# EAGLE design hdmispi (EAGLE 7.6.0)
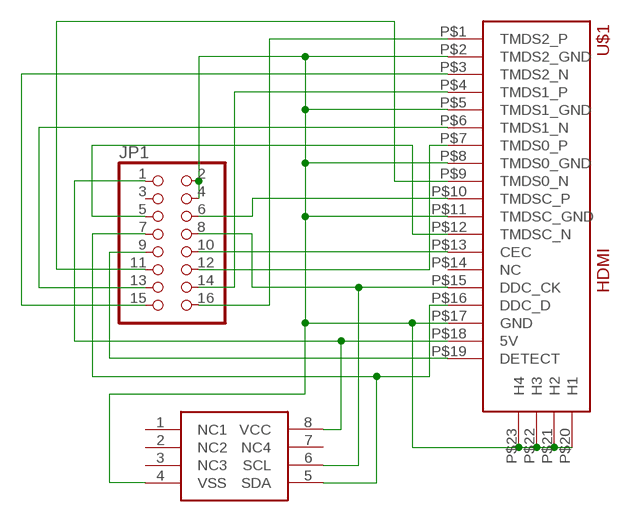
[diagram p0: schematic, sheet 1]

## Parts
JP1  PINHD-2X8  [2X08]
U$1  HDMI  [HDMI]
U$2  I2CEEPROM-SOIC8  [SOIC8]

## Nets
5V: JP1.1 U$1.P$18(5V) U$2.8(VCC)
CEC: JP1.10 U$1.P$13(CEC)
DDC_CK: JP1.8 U$1.P$15(DDC_CK) U$2.6(SCL)
DDC_D: JP1.7 U$1.P$16(DDC_D) U$2.5(SDA)
DETECT: JP1.9 U$1.P$19(DETECT)
GND: JP1.2 JP1.4 U$1.P$2(TMDS2_GND) U$1.P$5(TMDS1_GND) U$1.P$8(TMDS0_GND) U$1.P$11(TMDSC_GND) U$1.P$17(GND) U$1.P$20(H1) U$1.P$21(H2) U$1.P$22(H3) U$1.P$23(H4) U$2.4(VSS)
TMDS0_N: JP1.11 U$1.P$9(TMDS0_N)
TMDS0_P: JP1.12 U$1.P$7(TMDS0_P)
TMDS1_N: JP1.13 U$1.P$6(TMDS1_N)
TMDS1_P: JP1.14 U$1.P$4(TMDS1_P)
TMDS2_N: JP1.15 U$1.P$3(TMDS2_N)
TMDS2_P: JP1.16 U$1.P$1(TMDS2_P)
TMDSC_N: JP1.5 U$1.P$12(TMDSC_N)
TMDSC_P: JP1.6 U$1.P$10(TMDSC_P)
Unconnected: JP1.3 U$1.P$14(NC) U$2.1(NC1) U$2.2(NC2) U$2.3(NC3) U$2.7(NC4)

## Library data of the parts
JP1 = pinhead:PINHD-2X8: PIN HEADER
U$1 = hdmispi:HDMI
U$2 = hdmispi:I2CEEPROM-SOIC8

## Board
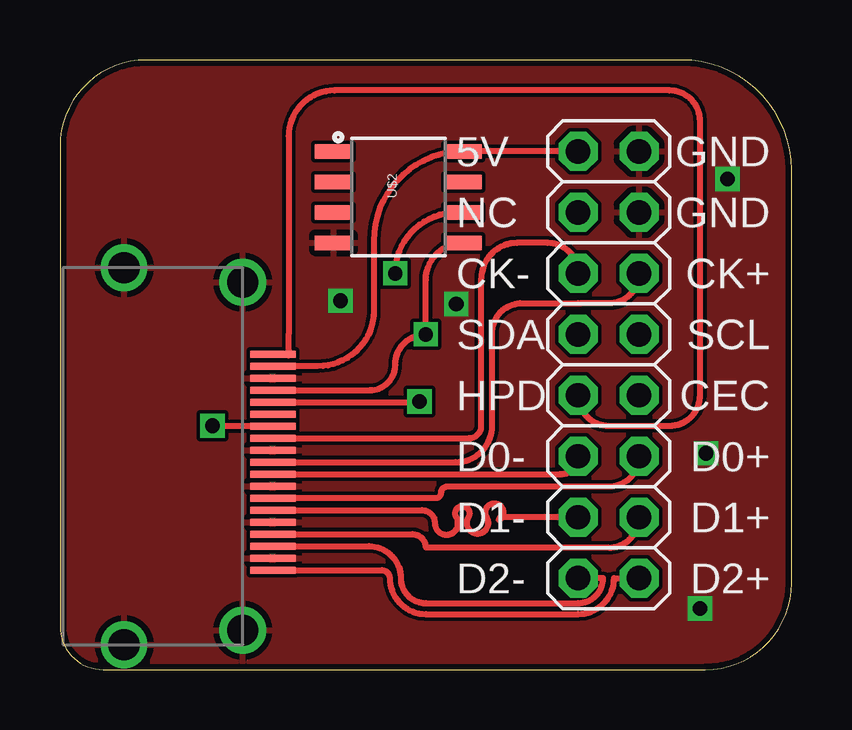
[diagram p1: board, top side]
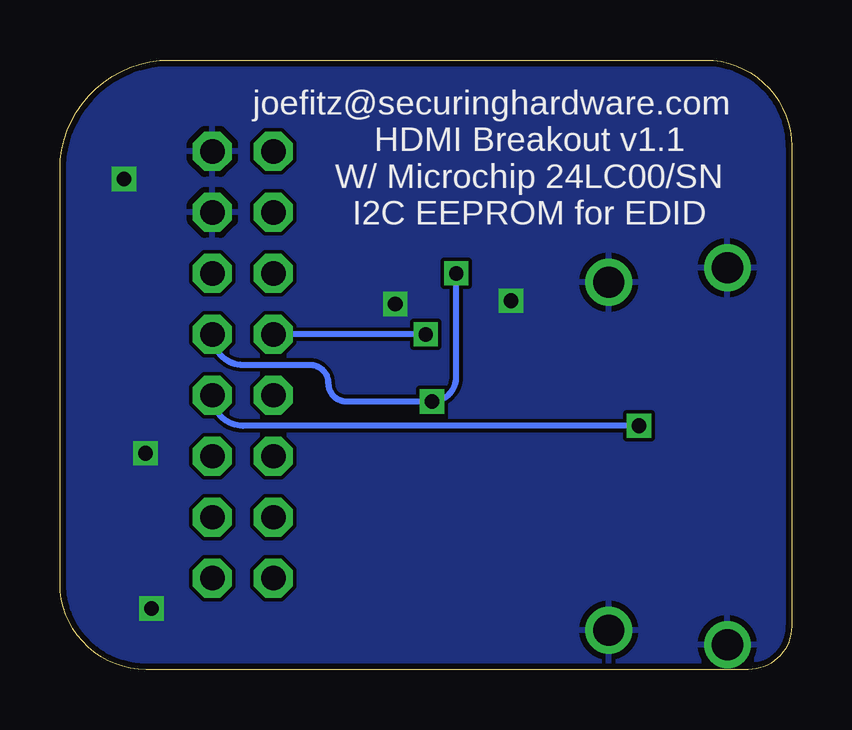
[diagram p2: board, bottom side, seen from below]

Size 30.48 x 25.4 mm. Coordinates in mm from the lower left corner, seen from the top.
Outline: 25.9,25.4 3.59,25.4 arc90 0,21.81 0,1.8 arc90 1.8,0 26.89,0 arc90 30.48,3.59 30.48,20.82 arc90 25.9,25.4
Copper layers (1*16): Top 0.035mm / dielectric 1.5mm / Bottom 0.035mm
Design rules "DFRobot_Eagle_Rule_v0.4": minimum track width 6mil, minimum drill 12mil, track to track 6mil, track to pad 6mil, pad to pad 6mil, via to via 6mil, smd to smd 0mil, copper to edge 10mil, drill to drill 10mil, minimum pad ring 12mil, minimum via ring 8mil, stop-mask expansion 2mil, vias tented up to drill 25mil, thermal gap 10mil

### Footprints (pad centres in the part's own frame; a part is rotated, then mirrored left to right if it is on the bottom)
2X08 = drill 1.016 octagon: 1 -8.89,-1.27; 2 -8.89,1.27; 3 -6.35,-1.27; 4 -6.35,1.27; 5 -3.81,-1.27; 6 -3.81,1.27; 7 -1.27,-1.27; 8 -1.27,1.27; 9 1.27,-1.27; 10 1.27,1.27; 11 3.81,-1.27; 12 3.81,1.27; 13 6.35,-1.27; 14 6.35,1.27; 15 8.89,-1.27; 16 8.89,1.27
HDMI = smd 0.3 x 1.9: P$1 4.75,1.254; P$2 4.25,1.254; P$3 3.75,1.254; P$4 3.25,1.254; P$5 2.75,1.254; P$6 2.25,1.254; P$7 1.75,1.254; P$8 1.25,1.254; P$9 0.75,1.254; P$10 0.25,1.254; P$11 -0.25,1.254; P$12 -0.75,1.254; P$13 -1.25,1.254; P$14 -1.75,1.254; P$15 -2.25,1.254; P$16 -2.75,1.254; P$17 -3.25,1.254; P$18 -3.75,1.254; P$19 -4.25,1.254 | drill 1.3: P$20 -7.25,0; P$21 -7.85,-4.95; P$22 7.85,-4.95; P$23 7.25,0
SOIC8 = smd 0.6 x 1.55: 1 -1.905,-2.7; 2 -0.635,-2.7; 3 0.635,-2.7; 4 1.905,-2.7; 5 1.905,2.7; 6 0.635,2.7; 7 -0.635,2.7; 8 -1.905,2.7

### Placement (x,y rotation side)
JP1  22.86,12.7 270 top
U$1  7.62,8.89 270 top
U$2  14.1,19.68 270 top

### Tracks (layer width: path | path; a pad name or v marks a point on that pad's centre or on a via)
5V
  Top 0.254: JP1.1 U$2.8 arc90 13.08,17.87 13.08,14.99 arc-90 10.73,12.64 U$1.P$18
CEC  (via drill 0.61)
  Top 0.254: U$1.P$13 6.37,10.14 arc-90 v6.35,10.16
  Bottom 0.254: v6.35,10.16 22.86,10.16 arc90 JP1.10
DDC_CK  (via drill 0.6, 0.61)
  Top 0.254: U$1.P$15 14.95,11.14 v14.99,11.18 | v13.97,16.51 arc-90 16.51,19.05 U$2.6
  Bottom 0.254: JP1.8 arc-90 22.86,12.7 20.07,12.7 arc90 19.3,11.94 arc-90 18.54,11.18 v14.99,11.18 arc-90 13.97,12.19 v13.97,16.51
DDC_D  (via drill 0.6)
  Top 0.254: U$1.P$16 12.91,11.64 arc90 13.97,12.7 arc-90 v15.24,13.97 15.24,16.22 arc-90 U$2.5
  Bottom 0.254: v15.24,13.97 JP1.7
DETECT
  Top 0.254: JP1.9 arc90 22.86,10.16 25.4,10.16 arc90 26.67,11.43 26.67,22.86 arc90 25.4,24.13 11.43,24.13 arc90 9.53,22.23 9.53,13.97 9.53,13.34 | U$1.P$19 9.33,13.14 arc90 9.53,13.34 | 9.53,13.34 9.53,13.08
GND  (via drill 0.61)
  other vias: 26.67,2.54 16.51,15.24 27.81,20.45 11.68,15.37 26.92,9.02
  pour Top: 0,0 50.8,0 50.8,26.67 0,26.67
  pour Bottom: 0,0 50.8,0 50.8,26.67 0,26.67
TMDS0_N
  Top 0.254: U$1.P$9 20.84,8.14 arc90 JP1.11
TMDS0_P
  Top 0.254: JP1.12 arc-90 22.86,7.62 16.13,7.62 arc90 15.88,7.37 arc-90 15.65,7.14 U$1.P$7
TMDS1_N
  Top 0.254: U$1.P$6 15.08,6.64 arc-90 15.62,6.1 arc212 16.51,6.35 arc-244 17.02,6.35 arc244 17.78,6.35 arc-272 18.29,6.22 arc-90 18.41,6.35 JP1.13
TMDS1_P
  Top 0.254: U$1.P$4 14.68,5.64 arc-90 15.24,5.08 22.86,5.08 arc90 JP1.14
TMDS2_N
  Top 0.254: U$1.P$3 12.87,5.14 arc-90 14.2,3.81 arc90 15.24,2.77 21.59,2.77 arc90 22.63,3.81 JP1.15
TMDS2_P
  Top 0.254: U$1.P$1 13.41,4.14 arc-90 13.74,3.81 arc90 15.24,2.31 21.59,2.31 arc90 23.09,3.81 JP1.16
TMDSC_N
  Top 0.254: U$1.P$12 17.03,9.64 arc90 17.55,10.16 17.55,16.28 arc-90 19.05,17.78 20.32,17.78 arc-90 JP1.5
TMDSC_P
  Top 0.254: U$1.P$10 16.49,8.64 arc90 18.01,10.16 18.01,13.97 arc-90 19.18,15.27 21.59,15.27 21.72,15.27 22.89,15.27 arc90 JP1.6

### Text on the board
tNames: 5V / NC / CK- / SDA / HPD / D0- / D1- / D2- | GND / GND / CK+ / SCL / CEC / D0+ / D1+ / D2+
bNames: joefitz@securinghardware.com / HDMI Breakout v1.1 / W/ Microchip 24LC00/SN / I2C EEPROM for EDID